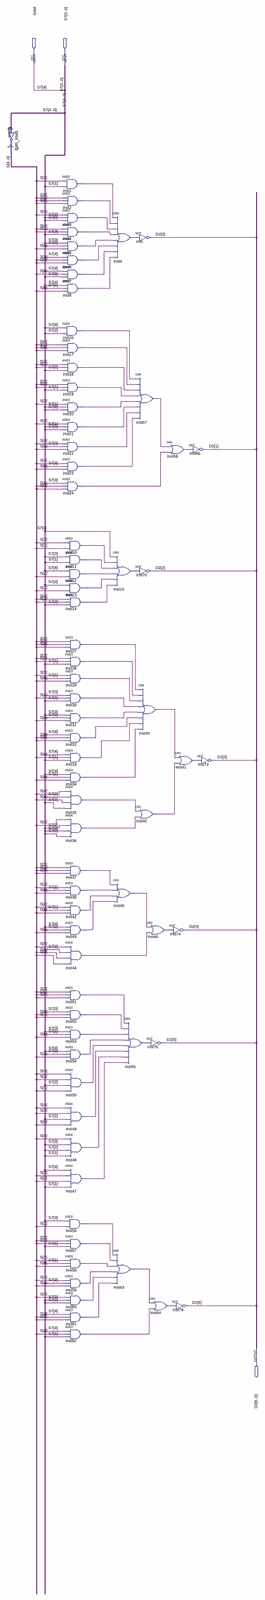
[diagram p0: schematic sheet, whole]
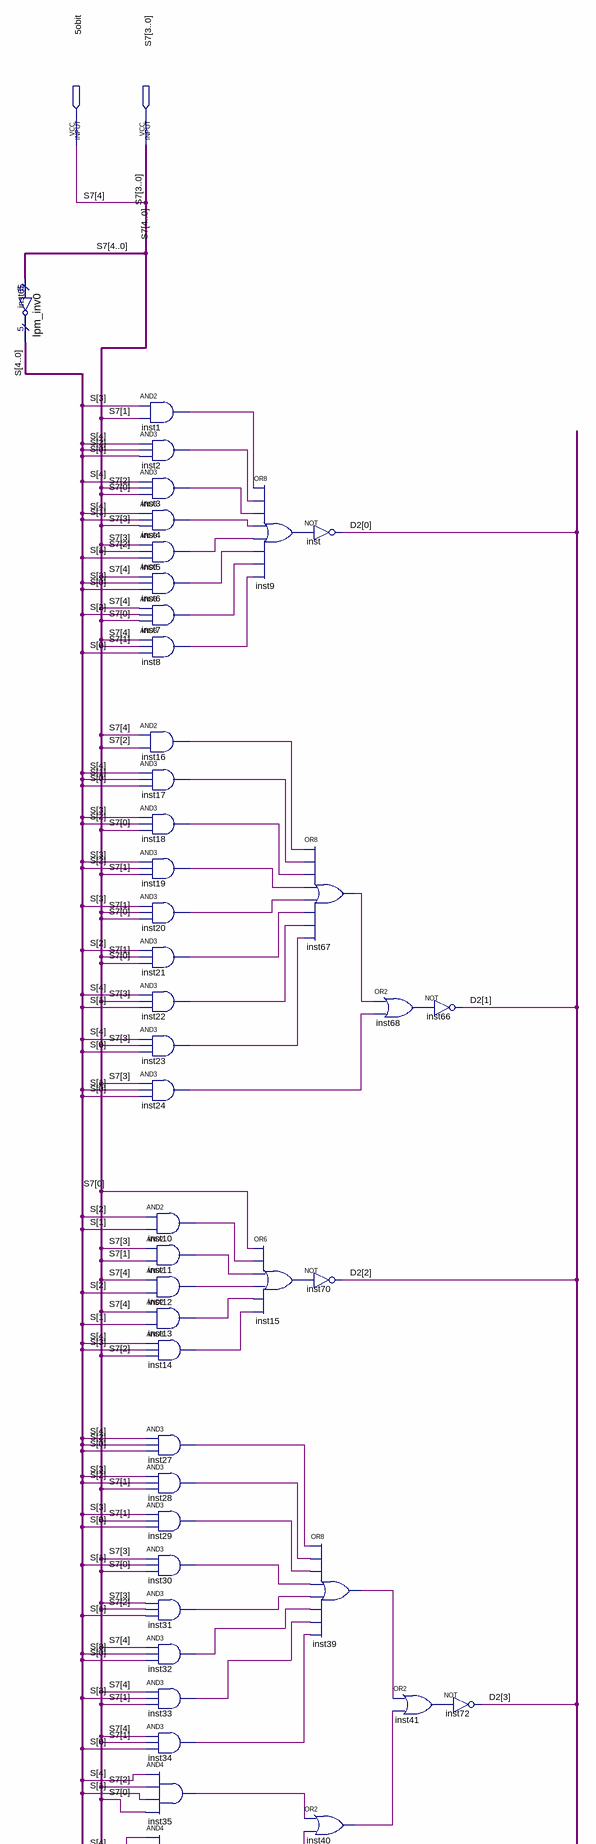
[diagram p1: schematic sheet, upper part]
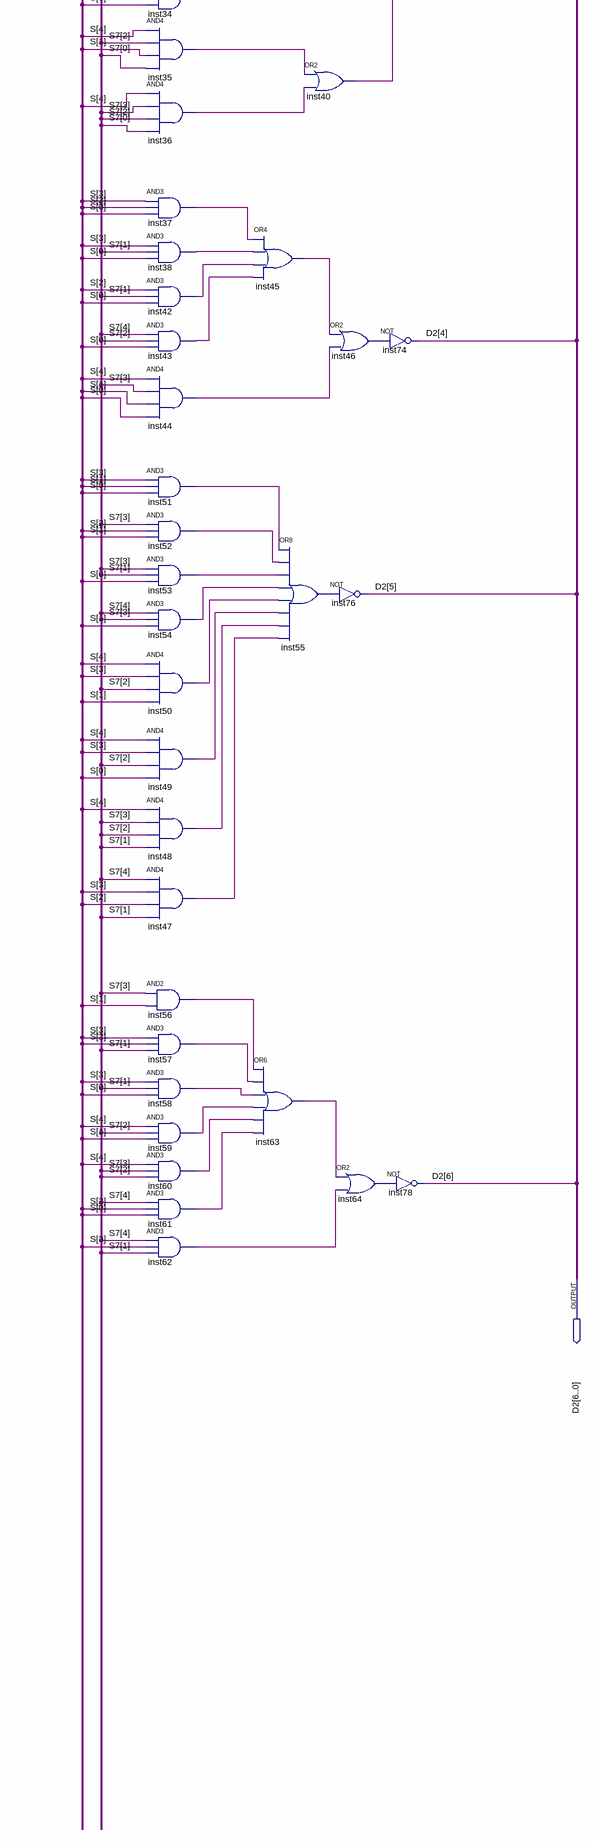
[diagram p2: schematic sheet, lower part]
// Quartus schematic displayDireita.bdf as structural Verilog: 72 symbols, 3 pins
module displayDireita (
  input  \5obit ,
  input  [3:0] S7,
  output [6:0] D2
);

  wire inst1_out, inst2_out, inst3_out, inst4_out, inst5_out, inst6_out, inst7_out, inst8_out, inst9_out,
       inst10_out, inst11_out, inst12_out, inst13_out, inst14_out, inst15_out, inst16_out, inst17_out,
       inst18_out, inst19_out, inst20_out, inst21_out, inst22_out, inst23_out, inst24_out, inst27_out,
       inst28_out, inst29_out, inst30_out, inst31_out, inst32_out, inst33_out, inst34_out, inst35_out,
       inst36_out, inst37_out, inst38_out, inst39_out, inst40_out, inst41_out, inst42_out, inst43_out,
       inst44_out, inst45_out, inst46_out, inst47_out, inst48_out, inst49_out, inst50_out, inst51_out,
       inst52_out, inst53_out, inst54_out, inst55_out, inst56_out, inst57_out, inst58_out, inst59_out,
       inst60_out, inst61_out, inst62_out, inst63_out, inst64_out, inst67_out, inst68_out;
  wire [4:0] S;

  lpm_inv0 inst65 (.data({\5obit , S7}), .result(S));
  and inst1 (inst1_out, S[3], S7[1]);
  and inst2 (inst2_out, S[4], S[2], S[0]);
  and inst3 (inst3_out, S[4], S7[2], S7[0]);
  and inst4 (inst4_out, S[4], S[1], S7[3]);
  and inst5 (inst5_out, S7[3], S7[2], S[1]);
  and inst6 (inst6_out, \5obit , S[3], S[0]);
  and inst7 (inst7_out, \5obit , S[2], S7[0]);
  and inst8 (inst8_out, \5obit , S7[1], S[0]);
  and inst16 (inst16_out, \5obit , S7[2]);
  and inst17 (inst17_out, S[4], S[1], S[0]);
  and inst18 (inst18_out, S[3], S[2], S7[0]);
  and inst19 (inst19_out, S[3], S[2], S7[1]);
  and inst20 (inst20_out, S[3], S7[1], S7[0]);
  and inst21 (inst21_out, S[2], S7[1], S7[0]);
  and inst22 (inst22_out, S[4], S7[3], S[1]);
  and inst23 (inst23_out, S[4], S7[3], S[0]);
  and inst24 (inst24_out, S7[3], S[1], S[0]);
  and inst10 (inst10_out, S[2], S[1]);
  and inst11 (inst11_out, S7[3], S7[1]);
  and inst12 (inst12_out, \5obit , S[2]);
  and inst13 (inst13_out, \5obit , S[1]);
  and inst14 (inst14_out, S[4], S[3], S7[2]);
  and inst27 (inst27_out, S[4], S[2], S[0]);
  and inst28 (inst28_out, S[3], S[2], S7[1]);
  and inst29 (inst29_out, S[3], S7[1], S[0]);
  and inst30 (inst30_out, S7[3], S[1], S7[0]);
  and inst31 (inst31_out, S7[3], S7[2], S[1]);
  and inst32 (inst32_out, \5obit , S[3], S[0]);
  and inst33 (inst33_out, \5obit , S[3], S7[1]);
  and inst34 (inst34_out, \5obit , S7[1], S[0]);
  and inst35 (inst35_out, S[4], S7[2], S[1], S7[0]);
  and inst36 (inst36_out, S[4], S7[3], S7[2], S7[0]);
  and inst37 (inst37_out, S[3], S[2], S[0]);
  and inst38 (inst38_out, S[3], S7[1], S[0]);
  and inst42 (inst42_out, S[2], S7[1], S[0]);
  and inst43 (inst43_out, \5obit , S7[2], S[0]);
  and inst44 (inst44_out, S[4], S7[3], S[1], S[0]);
  and inst51 (inst51_out, S[3], S[1], S[0]);
  and inst52 (inst52_out, S7[3], S[2], S[1]);
  and inst53 (inst53_out, S7[3], S7[1], S[0]);
  and inst54 (inst54_out, \5obit , S7[3], S[1]);
  and inst50 (inst50_out, S[4], S[3], S7[2], S[1]);
  and inst49 (inst49_out, S[4], S[3], S7[2], S[0]);
  and inst48 (inst48_out, S[4], S7[3], S7[2], S7[1]);
  and inst47 (inst47_out, \5obit , S[3], S[2], S7[1]);
  and inst56 (inst56_out, S7[3], S[1]);
  and inst57 (inst57_out, S[3], S[2], S7[1]);
  and inst58 (inst58_out, S[3], S7[1], S[0]);
  and inst59 (inst59_out, S[4], S7[2], S[1]);
  and inst60 (inst60_out, S[4], S7[3], S7[2]);
  and inst61 (inst61_out, \5obit , S[2], S[0]);
  and inst62 (inst62_out, \5obit , S[3], S7[1]);
  or inst9 (inst9_out, inst1_out, inst2_out, inst3_out, inst4_out, inst5_out, inst6_out, inst7_out, inst8_out);
  or inst15 (inst15_out, S7[0], inst10_out, inst11_out, inst12_out, inst13_out, inst14_out);
  or inst45 (inst45_out, inst37_out, inst38_out, inst42_out, inst43_out);
  or inst63 (inst63_out, inst56_out, inst57_out, inst58_out, inst59_out, inst60_out, inst61_out);
  not inst (D2[0], inst9_out);
  or inst67 (inst67_out, inst16_out, inst17_out, inst18_out, inst19_out, inst20_out, inst21_out, inst22_out, inst23_out);
  not inst70 (D2[2], inst15_out);
  or inst39 (inst39_out, inst27_out, inst28_out, inst29_out, inst30_out, inst31_out, inst32_out, inst33_out, inst34_out);
  or inst40 (inst40_out, inst35_out, inst36_out);
  or inst55 (inst55_out, inst51_out, inst52_out, inst53_out, inst54_out, inst50_out, inst49_out, inst48_out, inst47_out);
  or inst46 (inst46_out, inst45_out, inst44_out);
  not inst76 (D2[5], inst55_out);
  or inst64 (inst64_out, inst63_out, inst62_out);
  or inst68 (inst68_out, inst67_out, inst24_out);
  or inst41 (inst41_out, inst39_out, inst40_out);
  not inst74 (D2[4], inst46_out);
  not inst78 (D2[6], inst64_out);
  not inst66 (D2[1], inst68_out);
  not inst72 (D2[3], inst41_out);

  // Other names for the same wires on the sheet: S7[4] = \5obit 
endmodule
